# EAGLE schematic ADIS16209 Teensy rev1 (EAGLE 9.5.0)
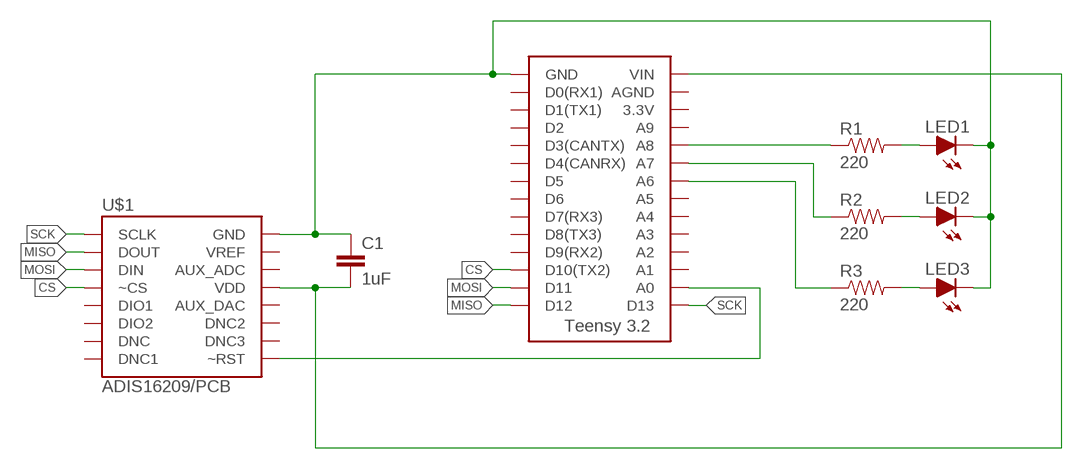
[diagram p0: schematic, sheet 1]

## Parts
C1  1uF  CAPKIT  [CAP-PTH-SMALL-KIT]
LED1  LED-5MM  [LED-5MM]
LED2  LED-5MM  [LED-5MM]
LED3  LED-5MM  [LED-5MM]
R1  220  RESISTORPTH-1/4W  [AXIAL-0.4]
R2  220  RESISTORPTH-1/4W  [AXIAL-0.4]
R3  220  RESISTORPTH-1/4W  [AXIAL-0.4]
U$1  ADIS16209/PCB  [ADIS16209/PCB]
U$2  TEENSY_3.2_SIMPLE  [TEENSY_3.2_SIMPLE]

## Nets
+3V3: C1.2 U$1.P$10(VDD) U$1.P$11(VDD) U$1.P$12(VDD) U$2.VIN
CS: U$1.P$3(~CS) U$2.D10(TX2)
GND: C1.1 LED1.K(C) LED2.K(C) LED3.K(C) U$1.P$7(GND) U$1.P$8(GND) U$1.P$14(GND) U$1.P$17(GND) U$2.GND
MISO: U$1.P$4(DOUT) U$2.D12
MOSI: U$1.P$6(DIN) U$2.D11
N$1: LED1.A R1.P$2
N$2: U$1.P$1(~RST) U$2.A0
N$3: R1.P$1 U$2.A8
N$4: R2.P$1 U$2.A7
N$5: R3.P$1 U$2.A6
N$6: LED2.A R2.P$2
N$7: LED3.A R3.P$2
SCK: U$1.P$2(SCLK) U$2.D13
Unconnected: U$1.P$5(VREF) U$1.P$9(VREF) U$1.P$13(AUX_ADC) U$1.P$15(AUX_DAC) U$1.P$16(VREF) U$1.P$18(VREF) U$1.P$19(DNC3) U$1.P$20(DNC2) U$1.P$21(DNC1) U$1.P$22(DNC) U$1.P$23(DIO2) U$1.P$24(DIO1) U$2.3.3V U$2.A1 U$2.A2 U$2.A3 U$2.A4 U$2.A5 U$2.A9 U$2.AGND U$2.D0(RX1) U$2.D1(TX1) U$2.D2 U$2.D3(CANTX) U$2.D4(CANRX) U$2.D5 U$2.D6 U$2.D7(RX3) U$2.D8(TX3) U$2.D9(RX2)

## Library data of the parts
C1 = HyTechDevices:CAP: Capacitor Standard 0603 ceramic capacitor, and 0.1" leaded capacitor.
LED1-LED3 = HyTechDevices:LED: Light Emitting Diode (LED) Source: Dangerous Prototypes Eagle Library <https://github.com/DangerousPrototypes/Eagle_Part_Library>
R1-R3 = HyTechDevices:RESISTOR: Resistor Basic schematic elements and footprints for 0603, 1206, and PTH resistors.
U$1 = HyTechDevices:ADIS16209: Analog Devices ADIS16209 High Accuracy, Dual-Axis Digital Inclinometer and Accelerometer
U$2 = HyTechDevices:TEENSY_3.2_SIMPLE: Simple version of the Teensy 3.2 board that only uses the 2 main rows of pins, not the inner pins or the pins opposite the usb port.